# EasyEDA schematic SCH_SPACE_MEMR_RES_2024-09-22.json
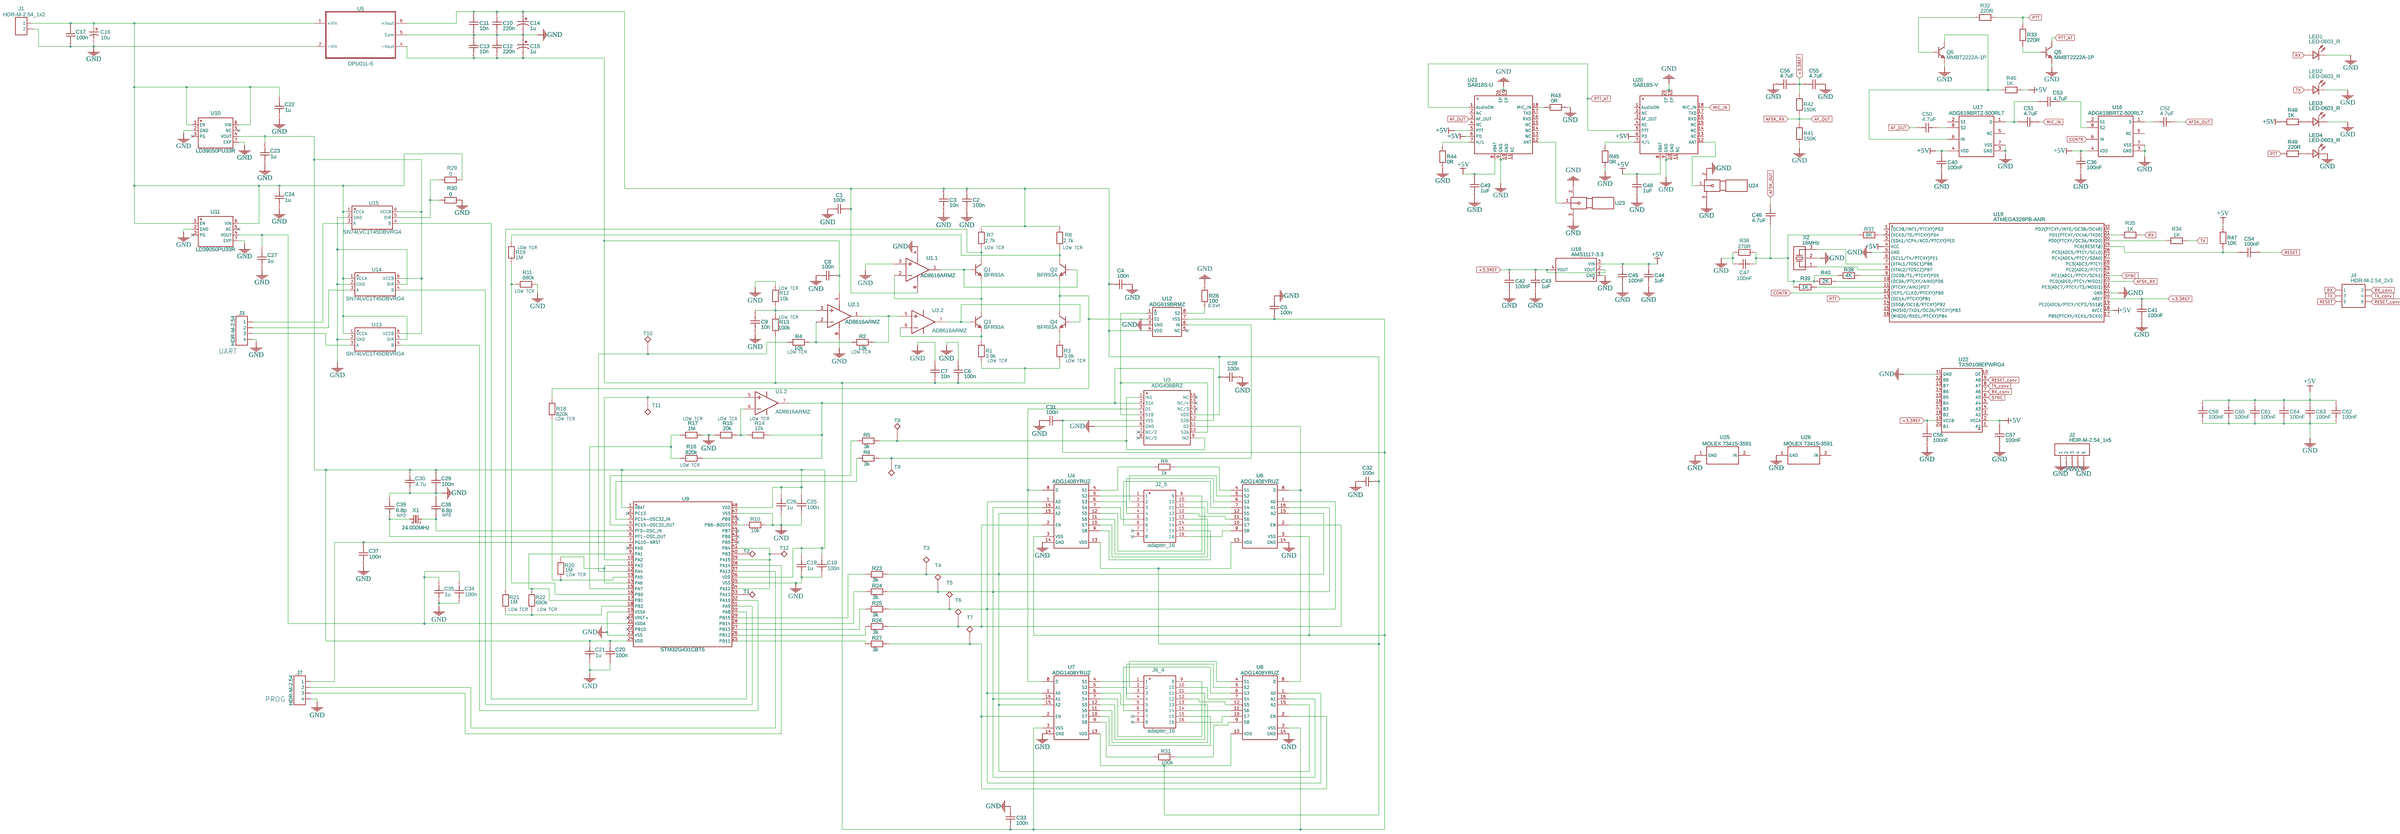
[diagram p0: schematic sheet]

## Parts
C1  100n  [C0805]
C2  100n  [C0805]
C3  10n  [C0805]
C4  100n  [C0805]
C5  100n  [C0805]
C6  100n  [C0805]
C7  10n  [C0805]
C8  100n  [C0805]
C9  10n  [C0805]
C10  220n  [C0805]
C11  10n  [C0805]
C12  220n  [C0805]
C13  10n  [C0805]
C14  1u  [CAP-D4.0×H5.5]
C15  1u  [CAP-D4.0×H5.5]
C16  10u  [7343]
C17  100n  [C0805]
C18  100n  [C0805]
C19  1u  [C0805]
C20  100n  [C0805]
C21  1u  [C0805]
C22  1u  [C0805]
C23  1u  [C0805]
C24  1u  [C0805]
C25  100n  [C0805]
C26  1u  [C0805]
C27  1u  [C0805]
C28  100n  [C0805]
C29  100n  [C0805]
C30  4.7u  [C0805]
C31  100n  [C0805]
C32  100n  [C0805]
C33  100n  [C0805]
C34  100n  [C0805]
C35  1u  [C0805]
C36  100nF  [C0603]
C37  100n  [C0805]
C38  6.8p  [C0805]
C39  6.8p  [C0805]
C40  100nF  [C0603]
C41  100nF  [C0603]
C42  100nF  [C0603]
C43  1uF  [C0603]
C44  1uF  [C0603]
C45  100nF  [C0603]
C46  4.7uF  [C0603]
C47  100nF  [C0603]
C48  1uF  [C0603]
C49  1uF  [C0603]
C50  4.7uF  [C0603]
C51  4.7uF  [C0603]
C52  4.7uF  [C0603]
C53  4.7uF  [C0603]
C54  100nF  [C0603]
C55  4.7uF  [C0603]
C56  4.7uF  [C0603]
C57  100nF  [C0603]
C58  100nF  [C0603]
C59  100nF  [C0603]
C60  100nF  [C0603]
C61  100nF  [C0603]
C62  100nF  [C0603]
C63  100nF  [C0603]
C64  100nF  [C0603]
J1  HDR-M-2.54_1x2  [HDR-M-2.54_1X2]
J2  HDR-M-2.54_1x5  [HDR-M-2.54_1X5]
J2_5  adapter_16  [ADAPTER_16]
J3  HDR-M-2.54  [HDR-M-2.54_1X4]
J4  HDR-M-2.54_2x3  [HDR-M-2.54_2X3]
J6_4  adapter_16  [ADAPTER_16]
J7  HDR-M-2.54  [HDR-M-2.54_1X4]
LED1  LED-0603_R  [LED0603_RED]
LED2  LED-0603_R  [LED0603_RED]
LED3  LED-0603_R  [LED0603_RED]
LED4  LED-0603_R  [LED0603_RED]
Q1  BFR93A  [SOT-23-3_L2.9-W1.4-P1.91-LS2.6-BR]
Q2  BFR93A  [SOT-23-3_L2.9-W1.4-P1.91-LS2.6-BR]
Q3  BFR93A  [SOT-23-3_L2.9-W1.4-P1.91-LS2.6-BR]
Q4  BFR93A  [SOT-23-3_L2.9-W1.4-P1.91-LS2.6-BR]
Q5  MMBT2222A-1P  [SOT-23-3_L3.0-W1.7-P0.95-LS2.9-BR]
Q6  MMBT2222A-1P  [SOT-23-3_L3.0-W1.7-P0.95-LS2.9-BR]
R1  3.9k  [R0603-S]
R2  13k  [R0603_NEW]
R3  3.9k  [R0603-S]
R4  10k  [R0603_NEW]
R5  3k  [R0805]
R6  3k  [R0805]
R7  2.7k  [R0805]
R8  2.7k  [R0805]
R9  1k  [R0805]
R10  10k  [R0805]
R11  680k  [R0603]
R12  10k  [R0603_NEW]
R13  100k  [R0805]
R14  12k  [R0805]
R15  20k  [R0603_NEW]
R16  820k  [R0805]
R17  1M  [R0805]
R18  820k  [R0805]
R19  1M  [R0805]
R20  1M  [R0805]
R21  1M  [R0805]
R22  680k  [R0603]
R23  3k  [R0805]
R24  3k  [R0805]
R25  3k  [R0805]
R26  3k  [R0805]
R27  3k  [R0805]
R28  100  [R2512]
R29  0  [R0603]
R30  0  [R0603]
R31  100k  [R0805]
R32  220R  [R0603]
R33  220R  [R0603]
R34  1K  [R0603]
R35  1K  [R0603]
R36  270R  [R0603]
R37  8K  [R0603]
R38  4K  [R0603]
R39  1K  [R0603]
R40  2K  [R0603]
R41  150K  [R0603]
R42  150K  [R0603]
R43  0R  [R0603]
R44  0R  [R0603]
R45  0R  [R0603]
R46  1K  [R0603]
R47  10K  [R0603]
R48  1K  [R0603]
R49  220R  [R0603]
T1  TP  [0.8PAD]
T2  TP  [0.8PAD]
T3  TP  [0.8PAD]
T4  TP  [0.8PAD]
T5  TP  [0.8PAD]
T6  TP  [0.8PAD]
T7  TP  [0.8PAD]
T8  TP  [0.8PAD]
T9  TP  [0.8PAD]
T10  TP  [0.8PAD]
T11  TP  [0.8PAD]
T12  TP  [0.8PAD]
U1  AD8616ARMZ  [MSOP-8_L3.0-W3.0-P0.65-LS4.9-BL]  (sections 1,2)
U2  AD8616ARMZ  [MSOP-8_L3.0-W3.0-P0.65-LS4.9-BL]  (sections 1,2)
U3  ADG436BRZ  [SOIC-16_L9.9-W3.9-P1.27-LS6.0-BL]
U4  ADG1408YRUZ  [TSSOP-16_L5.0-W4.4-P0.65-LS6.4-BL]
U5  DPU01L-5  [PWRM-TH_TRACO_TMAXXXXD]
U6  ADG1408YRUZ  [TSSOP-16_L5.0-W4.4-P0.65-LS6.4-BL]
U7  ADG1408YRUZ  [TSSOP-16_L5.0-W4.4-P0.65-LS6.4-BL]
U8  ADG1408YRUZ  [TSSOP-16_L5.0-W4.4-P0.65-LS6.4-BL]
U9  STM32G431CBT6  [LQFP-48_L7.0-W7.0-P0.50-LS9.0-BL]
U10  LD39050PU33R  [DFN-6_L3.0-W3.0-P0.95-LS3.1-TL-EP]
U11  LD39050PU33R  [DFN-6_L3.0-W3.0-P0.95-LS3.1-TL-EP]
U12  ADG619BRMZ  [MSOP-8_L3.0-W3.0-P0.65-LS5.0-BL]
U13  SN74LVC1T45DBVRG4  [SOT-23-6_L2.9-W1.6-P0.95-LS2.8-TL]
U14  SN74LVC1T45DBVRG4  [SOT-23-6_L2.9-W1.6-P0.95-LS2.8-TL]
U15  SN74LVC1T45DBVRG4  [SOT-23-6_L2.9-W1.6-P0.95-LS2.8-TL]
U16  ADG619BRTZ-500RL7  [SOT-23-8_L3.0-W1.7-P0.65-LS2.8-TL]
U17  ADG619BRTZ-500RL7  [SOT-23-8_L3.0-W1.7-P0.65-LS2.8-TL]
U18  AMS1117-3.3  [SOT-223-3_L6.5-W3.4-P2.30-LS7.0-BR]
U19  ATMEGA328PB-ANR  [TQFP-32_L7.0-W7.0-P0.80-LS9.0-BL]
U20  SA818S-V  [WIRELM-SMD_G-NICERF_SA818S-X]
U21  SA818S-U  [WIRELM-SMD_G-NICERF_SA818S-X]
U22  TXS0108EPWRG4  [TSSOP-20_L6.5-W4.4-P0.65-LS6.5-BL]
U23  SMP-MSLD-PCE-5T  [SMA-SMD_SMP-MSLD-PCE-5T]
U24  SMP-MSLD-PCE-5T  [SMA-SMD_SMP-MSLD-PCE-5T]
U25  MOLEX 73415-3591  [MOLEX 73415-3591]
U26  MOLEX 73415-3591  [MOLEX 73415-3591]
X1  24.000MHz  [HC49S]
X2  16MHz  [OSC-SMD_3P-L3.2-W1.3-P0.95-L]

## Library data of the parts
C1-C13 C17-C35 C37-C39 = C_0805_US: Contributor: LCEDA_Lib
C14 C15 = CE_SMD_D4.0×H5.5_US: Contributor: LCEDA_Lib
C16 = Murata ECASD41B106M055K: Organic Polymer, Low ESR, Aluminium Capacitor: 10uF, 12.5V, 20%
C36 C40-C64 = C_0603_US: Contributor: LCEDA_Lib
J1 = HDR-M-2.54_1x2: Supplier Part: C124375; Supplier: LCSC; Contributor: LCEDA_Lib
J2 = HDR-M-2.54_1x5: Supplier Part: C358687; Supplier: LCSC; Contributor: LCEDA_Lib
J2_5 J6_4 = adapter_16: Contributor: madimtor
J3 J7 = HDR-M-2.54_1x4: Supplier Part: C124378; Supplier: LCSC; Contributor: LCEDA_Lib
J4 = HDR-M-2.54_2x3: Supplier Part: C65114; Supplier: LCSC; Contributor: LCEDA_Lib
LED1-LED4 = LED-0603_R: Manufacturer: EVERLIGHT(台湾亿光); Manufacturer Part: 19-217/R6C-AL1M2VY/3T; Supplier Part: C72044; Supplier: LCSC; Contributor: LCEDA_01
Q1-Q4 = BFR93A215: Supplier: LCSC; Supplier Part: C3195469; Manufacturer: NXP(恩智浦); Contributor: lcsc; JLCPCB Part Class: Extended Part
Q5 Q6 = MMBT2222A-1P: Contributor: LCSC; Supplier: LCSC; Supplier Part: C364315; Manufacturer: MDD(辰达半导体); JLCPCB Part Class: Extended Part; link: https://lcsc.com/eda_search?q=C364315&%26type=1&ref=editor
R1-R4 R7 R8 R11-R19 R28 = R_0805_EU: Contributor: LCEDA_Lib
R5 R6 R9 R10 R20-R27 R31 = R_1206_EU: Contributor: LCEDA_Lib
R29 R30 R32-R49 = R_0603_EU: Contributor: LCEDA_Lib
T1-T12 = TP: Contributor: Madim Tor
U1 U2 = AD8616ARMZ-REEL: subpart_no: 1; Supplier: LCSC; Supplier Part: C495278; Manufacturer: ADI(亚德诺); JLCPCB Part Class: Extended Part
U3 = ADG436BRZ: Contributor: LCSC; Supplier: LCSC; Supplier Part: C208199; Manufacturer: ADI(亚德诺); JLCPCB Part Class: Extended Part
U4 U6-U8 = ADG1408YRUZ-REEL7: Contributor: LCSC; Supplier: LCSC; Manufacturer: ADI(亚德诺); Supplier Part: C148081; JLCPCB Part Class: Extended Part
U5 = DPU01L-5: Contributor: kenson; Manufacturer: Mean Well
U9 = STM32G431CBT6_C9900046398: Contributor: lcsc; Supplier: LCSC; Supplier Part: C9900046398; Manufacturer: null
U10 U11 = LD39050PU33R: Contributor: LCSC; Supplier: LCSC; Manufacturer: ST(意法半导体); Supplier Part: C132827; JLCPCB Part Class: Extended Part
U12 = ADG619BRMZ-REEL: Contributor: LCSC; Supplier: LCSC; Supplier Part: C578047; Manufacturer: ADI(亚德诺); JLCPCB Part Class: Extended Part
U13-U15 = SN74LVC1T45DBVRG4: Contributor: LCSC; Supplier: LCSC; Supplier Part: C2677464; Manufacturer: TI(德州仪器); JLCPCB Part Class: Extended Part
U16 U17 = ADG619BRTZ-500RL7: Contributor: LCSC; Supplier: LCSC; Manufacturer: ADI(亚德诺); Supplier Part: C143876; JLCPCB Part Class: Extended Part; link: https://lcsc.com/eda_search?q=C143876&%26type=1&ref=editor
U18 = AMS1117-3.3: sourceId: dwIGgezVh; Supplier: LCSC; Manufacturer: AMS; Supplier Part: C6186; JLCPCB Part Class: Basic Part; link: https://lcsc.com/eda_search?q=C6186&%26type=1&ref=editor
U19 = ATMEGA328PB-ANR: Contributor: lcsc; Supplier: LCSC; Supplier Part: C2053137; Manufacturer: MICROCHIP(美国微芯); JLCPCB Part Class: Extended Part; link: https://lcsc.com/eda_search?q=C2053137&%26type=1&ref=editor
U20 U21 = SA818S-U: Contributor: lcsc; Supplier: LCSC; Supplier Part: C3001549; Manufacturer: G-NiceRF(思为无线); JLCPCB Part Class: Extended Part; link: https://lcsc.com/eda_search?q=C3001549&%26type=1&ref=editor
U22 = TXS0108EPWRG4: Supplier: LCSC; Supplier Part: C2677606; Manufacturer: TI(德州仪器); Contributor: LCSC; JLCPCB Part Class: Extended Part
U23 U24 = SMP-MSLD-PCE-5T: Supplier: LCSC; Supplier Part: C6297051; Manufacturer: Amphenol; JLCPCB Part Class: Extended Part; Contributor: lcsc; link: https://lcsc.com/eda_search?q=C6297051&%26type=1&ref=editor
U25 U26 = MOLEX 73415-3591: Contributor: Madim Tor
X1 = CRYSTALHC49S: CRYSTAL; Contributor: Adafruit
X2 = CSTCE16M0V53-R0: Supplier: LCSC; Manufacturer: muRata(村田); Supplier Part: C32180; JLCPCB Part Class: Extended Part

## Nets
+5V: C36.2 C40.2 C44.2 C45.2 C48.2 C49.2 C57.2 C59.2 C60.2 C61.2 C62.2 C63.2 C64.2 J2.2 J2.3 J2.4 R46.1 R47.1 R48.1 U16.4(VDD) U17.4(VDD) U18.3(VIN) U19.4(VCC) U19.18(AVCC) U20.6(PD) U20.8(VBAT) U21.5(PTT) U21.6(PD) U21.8(VBAT) U22.2(VCCA)
GND: C1.1 C2.1 C3.2 C4.1 C5.1 C6.2 C7.1 C8.1 C9.2 C10.2 C11.2 C12.1 C13.1 C14.2 C15.1 C16.2 C17.1 C18.1 C19.1 C20.1 C21.1 C22.1 C23.1 C24.1 C25.1 C26.1 C27.1 C28.1 C29.1 C30.1 C31.1 C32.1 C33.1 C34.1 C35.1 C36.1 C37.1 C38.2 C39.2 C40.1 C41.1 C42.1 C43.1 C44.1 C45.1 C47.2 C48.1 C49.1 C55.2 C56.1 C57.1 C58.1 C59.1 C60.1 C61.1 C62.1 C63.1 C64.1 J1.2 J2.1 J2.5 J3.4 J7.4 LED1.2 LED2.2 LED3.2 LED4.2 Q5.2(E) Q6.2(E) R10.2 R11.2 R12.2 R15.1 R17.2 R28.1 R30.2 R36.2 R41.1 R43.1 R44.1 R45.1 U1.3(+INA) U1.4(V-) U2.8(V+) U3.6(GND) U4.14(GND) U5.2(-Vin) U5.5(Com) U6.14(GND) U7.14(GND) U8.14(GND) U9.19(VSSA) U9.23(VSS) U9.35(VSS) U9.47(VSS) U10.2(GND) U10.7(EXP) U11.2(GND) U11.7(EXP) U12.3(GND) U13.2(GND) U14.2(GND) U14.5(DIR) U15.2(GND) U16.3(GND) U16.7(VSS) U17.3(GND) U17.7(VSS) U18.1(GND) U19.5(GND) U19.21(GND) U20.9(GND) U20.10(GND) U20.19(EP) U20.20(EP) U21.9(GND) U21.10(GND) U21.19(EP) U21.20(EP) U22.11(GND) U23.2 U23.3 U24.2 U24.3 U25.1(GND) U26.1(GND) X2.2
+3.3REF: C41.2 C42.2 C43.2 C55.1 C56.2 C58.2 R42.2 U18.2(VOUT) U18.4(VOUT) U19.20(AREF) U22.19(VCCB)
AFSK_OUT: C46.1 C52.1
AFSK_RX: C50.2 R41.2 R42.1 U19.23(PC0(ADC0/PTCY/MISO1)) U21.3(AF_OUT)
CONTR: U16.6(IN) U19.12((ICP1/CLKO/PTCXY)PB0)
MIC_IN: C51.1 U20.18(MIC_IN)
PTT: R32.1 R33.2 R49.2 U19.13((OC1A/PTCXY)PB1)
PTT_AT: Q5.3(C) U20.5(PTT) U21.1(AudioON)
RESET: C54.2 J4.5
RESET_conv: J4.6 U22.9(A8)
RX: J4.1 LED1.1 R35.1
RX_conv: J4.2 U22.7(A6)
SYNC: U19.24(PC1(ADC1/PTCY/SCK1)) U22.6(A5)
TX: J4.3 LED2.1 R34.1
TX_conv: J4.4 U22.8(A7)
Net-(C1-2): C1.2 C2.2 C3.1 C4.2 C10.1 C11.1 C14.1 C28.2 C32.2 R7.2 R8.2 U1.8(V+) U3.13(VDD) U4.13(VDD) U5.6(+Vout) U6.13(VDD) U7.13(VDD) U8.13(VDD) U12.4(VDD)
Net-(C5-2): C5.2 C6.1 C7.2 C8.2 C12.2 C13.2 C15.2 C31.2 C33.2 R1.1 R3.1 R13.1 U2.4(V-) U3.5(VSS) U4.3(VSS) U5.4(-Vout) U6.3(VSS) U7.3(VSS) U8.3(VSS) U12.7(VSS)
Net-(C9-1): C9.1 R12.1 R13.2 U2.3(+INA)
Net-(C16-1): C16.1 C17.2 C22.2 C24.2 J1.1 R29.2 U5.1(+Vin) U10.1(EN) U10.6(VIN) U11.1(EN) U11.6(VIN) U13.1(VCCA) U13.5(DIR) U14.1(VCCA) U15.1(VCCA)
Net-(C18-2): C18.2 C19.2 C20.2 C21.2 C23.2 C25.2 C26.2 C29.2 C30.2 U9.1(VBAT) U9.24(VDD) U9.36(VDD) U9.48(VDD) U10.4(VOUT) U13.6(VCCB) U14.6(VCCB) U15.6(VCCB)
Net-(C27-2): C27.2 C34.2 C35.2 U9.21(VDDA) U11.4(VOUT)
Net-(C37-2): C37.2 J7.1 U9.7(PG10-NRST)
Net-(C38-1): C38.1 U9.5(PF0-OSC_IN) X1.2
Net-(C39-1): C39.1 U9.6(PF1-OSC_OUT) X1.1
Net-(C46-2): C46.2 C47.1 R36.1 R37.2 R38.2 R39.2 R40.2
Net-(C50-1): C50.1 U17.8(S2)
Net-(C51-2): C51.2 C53.1 U17.1(D)
Net-(C52-2): C52.2 U16.1(D)
Net-(C53-2): C53.2 U16.8(S2)
Net-(C54-1): C54.1 R47.2 U19.29(PC6(RESET#))
Net-(J2_5-1): J2_5.1 U4.5(S2)
Net-(J2_5-2): J2_5.2 U6.5(S2)
Net-(J2_5-3): J2_5.3 U4.6(S3)
Net-(J2_5-4): J2_5.4 U6.6(S3)
Net-(J2_5-5): J2_5.5 U4.7(S4)
Net-(J2_5-6): J2_5.6 U6.7(S4)
Net-(J2_5-9): J2_5.9 U4.12(S5)
Net-(J2_5-10): J2_5.10 U6.12(S5)
Net-(J2_5-11): J2_5.11 U4.11(S6)
Net-(J2_5-12): J2_5.12 U6.11(S6)
Net-(J2_5-13): J2_5.13 U4.10(S7)
Net-(J2_5-14): J2_5.14 U6.10(S7)
Net-(J2_5-15): J2_5.15 U4.9(S8)
Net-(J2_5-16): J2_5.16 U6.9(S8)
Net-(J3-1): J3.1 U15.3(A)
Net-(J3-2): J3.2 U14.3(A)
Net-(J3-3): J3.3 U13.3(A)
Net-(J6_4-1): J6_4.1 U7.4(S1)
Net-(J6_4-2): J6_4.2 U8.4(S1)
Net-(J6_4-3): J6_4.3 U7.5(S2)
Net-(J6_4-4): J6_4.4 U8.5(S2)
Net-(J6_4-5): J6_4.5 U7.6(S3)
Net-(J6_4-6): J6_4.6 U8.6(S3)
Net-(J6_4-9): J6_4.9 U7.7(S4)
Net-(J6_4-10): J6_4.10 U8.7(S4)
Net-(J6_4-11): J6_4.11 U7.12(S5)
Net-(J6_4-12): J6_4.12 U8.12(S5)
Net-(J6_4-13): J6_4.13 U7.11(S6)
Net-(J6_4-14): J6_4.14 U8.11(S6)
Net-(J6_4-15): J6_4.15 U7.10(S7)
Net-(J6_4-16): J6_4.16 U8.10(S7)
Net-(J7-2): J7.2 U9.37(PA13)
Net-(J7-3): J7.3 U9.38(PA14)
Net-(LED3-1): LED3.1 R48.2
Net-(LED4-1): LED4.1 R49.1
Net-(Q1-1): Q1.1(B) Q2.1(B) U1.1(OUTA)
Net-(Q1-2): Q1.2(E) Q3.3(C) U1.2(-INA)
Net-(Q1-3): Q1.3(C) R7.1 R21.2
Net-(Q2-2): Q2.2(E) Q4.3(C) R18.2 U12.2(S1)
Net-(Q2-3): Q2.3(C) R8.1 R19.2
Net-(Q3-1): Q3.1(B) Q4.1(B) U2.7(OUTB)
Net-(Q3-2): Q3.2(E) R1.2 U2.6(-INB)
Net-(Q4-2): Q4.2(E) R3.2
Net-(Q5-1): Q5.1(B) R33.1
Net-(Q6-1): Q6.1(B) R32.2
Net-(Q6-3): Q6.3(C) R46.2 U17.6(IN)
Net-(R2-1): R2.1 R4.2 U2.2(-INA)
Net-(R2-2): R2.2 U2.1(OUTA) U2.5(+INB)
Net-(R4-1): R4.1 T10.4(1) U9.12(PA4)
Net-(R5-1): R5.1 U9.4(PC15-OSC32_OUT)
Net-(R5-2): R5.2 T8.4(1) U3.1(IN1) U3.9(IN2)
Net-(R6-1): R6.1 U9.3(PC14-OSC32_IN)
Net-(R6-2): R6.2 T9.4(1) U12.6(IN)
Net-(R9-1): R9.1 U4.4(S1)
Net-(R9-2): R9.2 U6.4(S1)
Net-(R10-1): R10.1 U9.45(PB8-BOOT0)
Net-(R11-1): R11.1 R19.1 U9.16(PB0)
Net-(R14-1): R14.1 R15.2 U1.6(-INB)
Net-(R14-2): R14.2 R16.2 U1.7(OUTB) U3.2(S1A) U3.12(S2B)
Net-(R16-1): R16.1 R17.1 U9.15(PA7)
Net-(R18-1): R18.1 R20.1 U9.13(PA5)
Net-(R20-2): R20.2 U9.11(PA3) U9.14(PA6)
Net-(R21-1): R21.1 R22.1 U9.18(PB2)
Net-(R22-2): R22.2 U9.9(PA1) U9.17(PB1)
Net-(R23-1): R23.1 U9.29(PB15)
Net-(R23-2): R23.2 T3.4(1) U4.15(A2) U6.15(A2) U7.15(A2) U8.15(A2)
Net-(R24-1): R24.1 U9.28(PB14)
Net-(R24-2): R24.2 T4.4(1) U4.16(A1) U6.16(A1) U7.16(A1) U8.16(A1)
Net-(R25-1): R25.1 U9.27(PB13)
Net-(R25-2): R25.2 T5.4(1) U4.1(A0) U6.1(A0) U7.1(A0) U8.1(A0)
Net-(R26-1): R26.1 U9.26(PB12)
Net-(R26-2): R26.2 T6.4(1) U4.2(EN) U6.2(EN)
Net-(R27-1): R27.1 U9.25(PB11)
Net-(R27-2): R27.2 T7.4(1) U7.2(EN) U8.2(EN)
Net-(R28-2): R28.2 U12.8(S2)
Net-(R29-1): R29.1 R30.1 U15.5(DIR)
Net-(R31-1): R31.1 U7.9(S8)
Net-(R31-2): R31.2 U8.9(S8)
Net-(R34-2): R34.2 U19.30(PD0(PTCXY/OC3A/RXD0))
Net-(R35-2): R35.2 U19.31(PD1(PTCXY/OC4A/TXD0))
Net-(R37-1): R37.1 U19.2((XCK0/T0/PTCXY)PD4)
Net-(R38-1): R38.1 U19.9((OC0B/T1/PTCXY)PD5)
Net-(R39-1): R39.1 U19.11((PTCXY/AIN1)PD7)
Net-(R40-1): R40.1 U19.10((OC0A/PTCXY/AIN0)PD6)
Net-(R43-2): R43.2 U21.18(MIC_IN)
Net-(R44-2): R44.2 U21.7(H/L)
Net-(R45-2): R45.2 U20.7(H/L)
Net-(T1-4): T1.4(1) U9.33(PA11)
Net-(T2-4): T2.4(1) U9.40(PB3)
Net-(T11-4): T11.4(1) U1.5(+INB) U9.10(PA2)
Net-(T12-4): T12.4(1) U9.34(PA12) U9.39(PA15) U9.41(PB4)
Net-(U3-3): U3.3(D1) U4.8(D) U7.8(D)
Net-(U3-4): U3.4(S1B) U3.10(S2A) U12.1(D)
Net-(U3-11): U3.11(D2) U6.8(D) U8.8(D)
Net-(U9-30): U9.30(PA8) U15.4(B)
Net-(U9-31): U9.31(PA9) U14.4(B)
Net-(U9-32): U9.32(PA10) U13.4(B)
Net-(U19-7): U19.7((XTAL1/TOSC1)PB6) X2.3
Net-(U19-8): U19.8((XTAL2/TOSC2)PB7) X2.1
Net-(U20-12): U20.12(ANT) U24.1
Net-(U21-12): U21.12(ANT) U23.1

Not connected (* = marked no-connect by the designer): J2_5 7* 8*; J6_4 7* 8*; U3 7(NC/2)* 8(NC/5)* 14(NC/3)* 15(NC/4)* 16(NC)*; U9 2(PC13)* 8(PA0)* 20(VREF+)* 22(PB10)* 42(PB5)* 43(PB6)* 44(PB7)* 46(PB9)*; U10 3(PG)* 5(NC)*; U11 3(PG)* 5(NC)*; U12 5(NC)*; U16 2(S1) 5(NC); U17 2(S1) 5(NC); U19 1((OC2B/INT1/PTCXY)PD3) 3((SDA1/ICP4/ACO/PTCXY)PE0) 6((SCL1/T4/PTCXY)PE1) 14((SS0#/OC1B/PTCXY)PB2) 15((MOSI0/TXD1/OC2A/PTCXY)PB3) 16((MISO0/RXD1/PTCXY)PB4) 17(PB5(PTCXY/XCK1/SCK0)) 19(PE2(ADC6/PTCY/ICP3/SS1#)) 22(PE3(ADC7/PTCY/T3/MOSI1)) 25(PC2(ADC2/PTCY)) 26(PC3(ADC3/PTCY)) 27(PC4(ADC4/PTCY/SDA0)) 28(PC5(ADC5/PTCY/SCL0)) 32(PD2(PTCXY/INT0/OC3B/OC4B)); U20 1(AudioON) 2(NC) 3(AF_OUT) 4(NC) 11(NC) 13(NC) 14(NC) 15(NC) 16(RXD) 17(TXD); U21 2(NC) 4(NC) 11(NC) 13(NC) 14(NC) 15(NC) 16(RXD) 17(TXD); U22 1(A1) 3(A2) 4(A3) 5(A4) 10(OE) 12(B8) 13(B7) 14(B6) 15(B5) 16(B4) 17(B3) 18(B2) 20(B1); U25 2(IN); U26 2(IN)

## Notes on the sheet
- LOW TCR
- LOW TCR
- LOW TCR
- LOW TCR
- LOW TCR
- 0.5W!
- LOW TCR
- UART
- LOW TCR
- LOW TCR
- LOW TCR
- LOW TCR
- LOW TCR
- LOW TCR
- LOW TCR
- LOW TCR
- LOW TCR
- NP0
- NP0
- LOW TCR
- LOW TCR
- LOW TCR
- PROG
